# Altium schematic sheet 3x3_v2.SchDoc
size A4
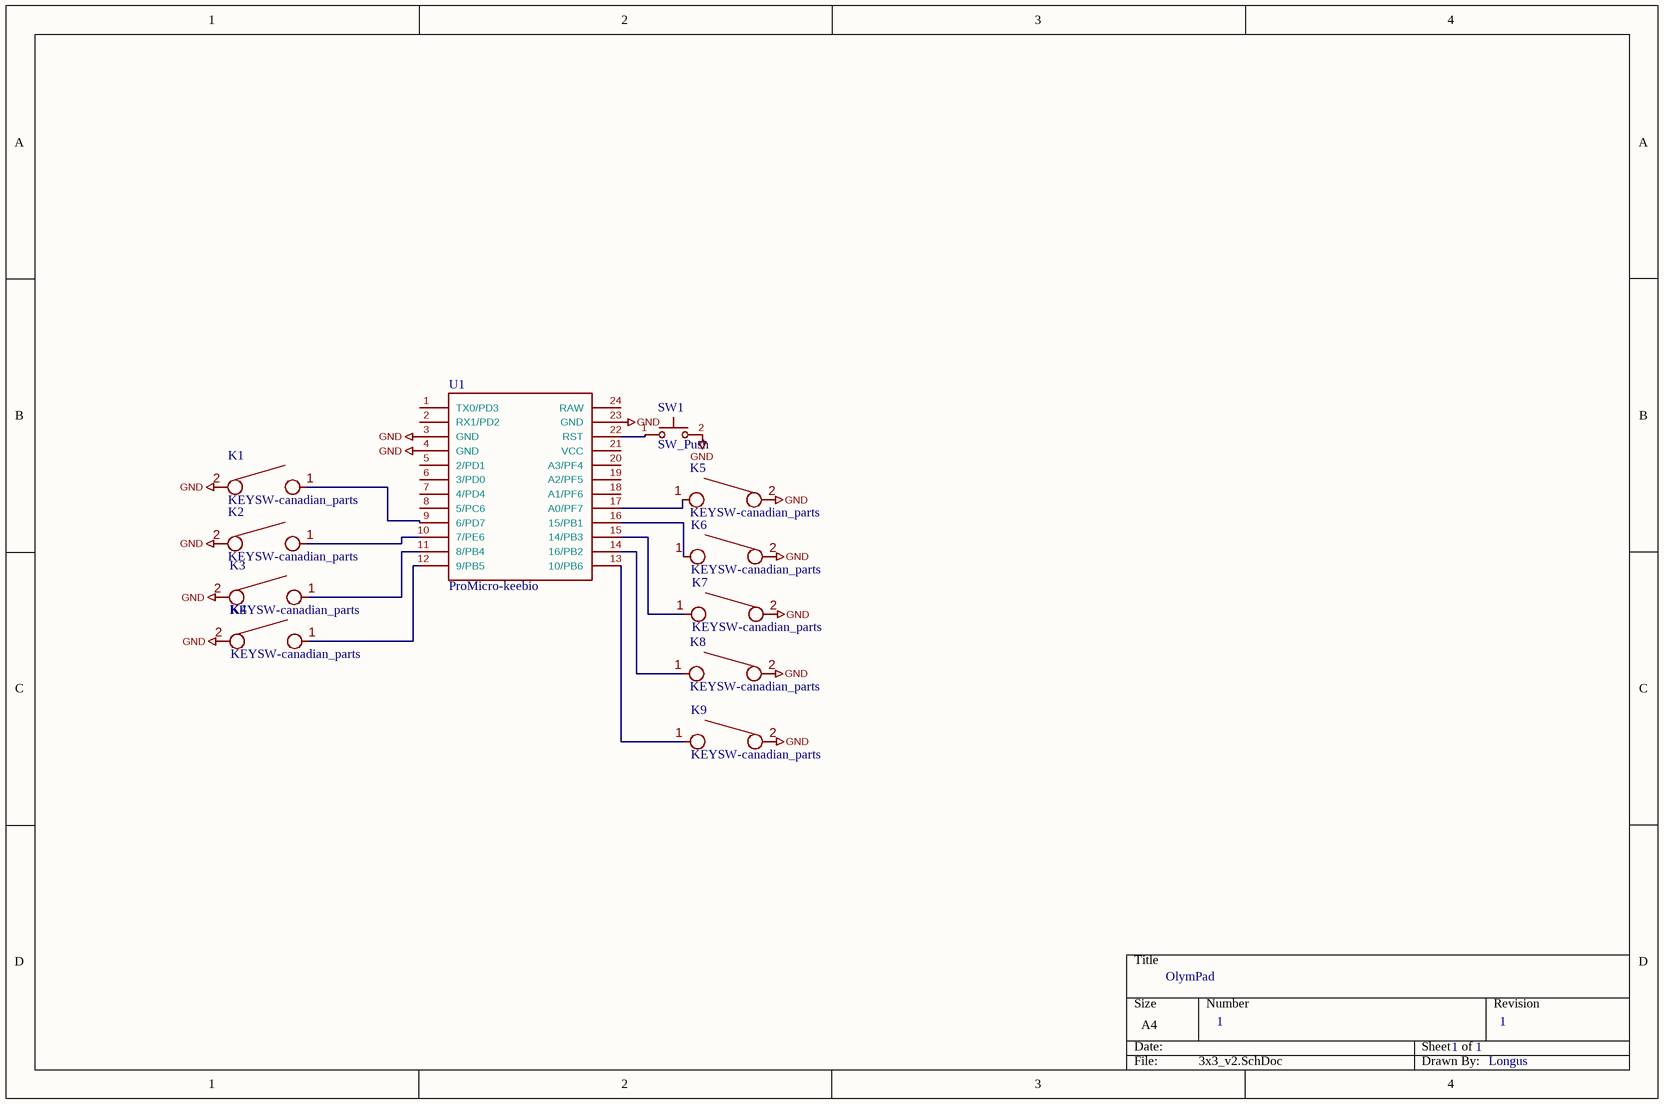
[diagram p0: 3x3_v2.SchDoc]

## Parts
K1  KEYSW-canadian_parts  [Socket]
K2  KEYSW-canadian_parts  [Socket]
K3  KEYSW-canadian_parts  [Socket]
K4  KEYSW-canadian_parts  [Socket]
K5  KEYSW-canadian_parts  [Socket]
K6  KEYSW-canadian_parts  [Socket]
K7  KEYSW-canadian_parts  [Socket]
K8  KEYSW-canadian_parts  [Socket]
K9  KEYSW-canadian_parts  [Socket]
SW1  SW_Push  [Reset]
U1  ProMicro-keebio  [Pro-Micro]

## Nets
GND: K1.2 K2.2 K3.2 K4.2 K5.2 K6.2 K7.2 K8.2 K9.2 SW1.2 U1.3(GND) U1.4(GND) U1.23(GND)
NetK1_1: K1.1 U1.9(6/PD7)
NetK2_1: K2.1 U1.10(7/PE6)
NetK3_1: K3.1 U1.11(8/PB4)
NetK4_1: K4.1 U1.12(9/PB5)
NetK5_1: K5.1 U1.17(A0/PF7)
NetK6_1: K6.1 U1.16(15/PB1)
NetK7_1: K7.1 U1.15(14/PB3)
NetK8_1: K8.1 U1.14(16/PB2)
NetK9_1: K9.1 U1.13(10/PB6)
NetSW1_1: SW1.1 U1.22(RST)

Not connected (* = marked no-connect by the designer): U1 1(TX0/PD3) 2(RX1/PD2) 5(2/PD1) 6(3/PD0) 7(4/PD4) 8(5/PC6) 18(A1/PF6) 19(A2/PF5) 20(A3/PF4) 21(VCC) 24(RAW)

## Notes on the sheet
- OlymPad
- 1
- 1     1
- Longus